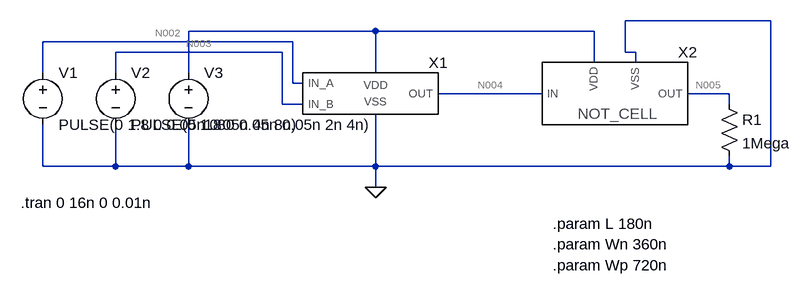
[diagram p0: schematic AND_SRAM_TB.asc]
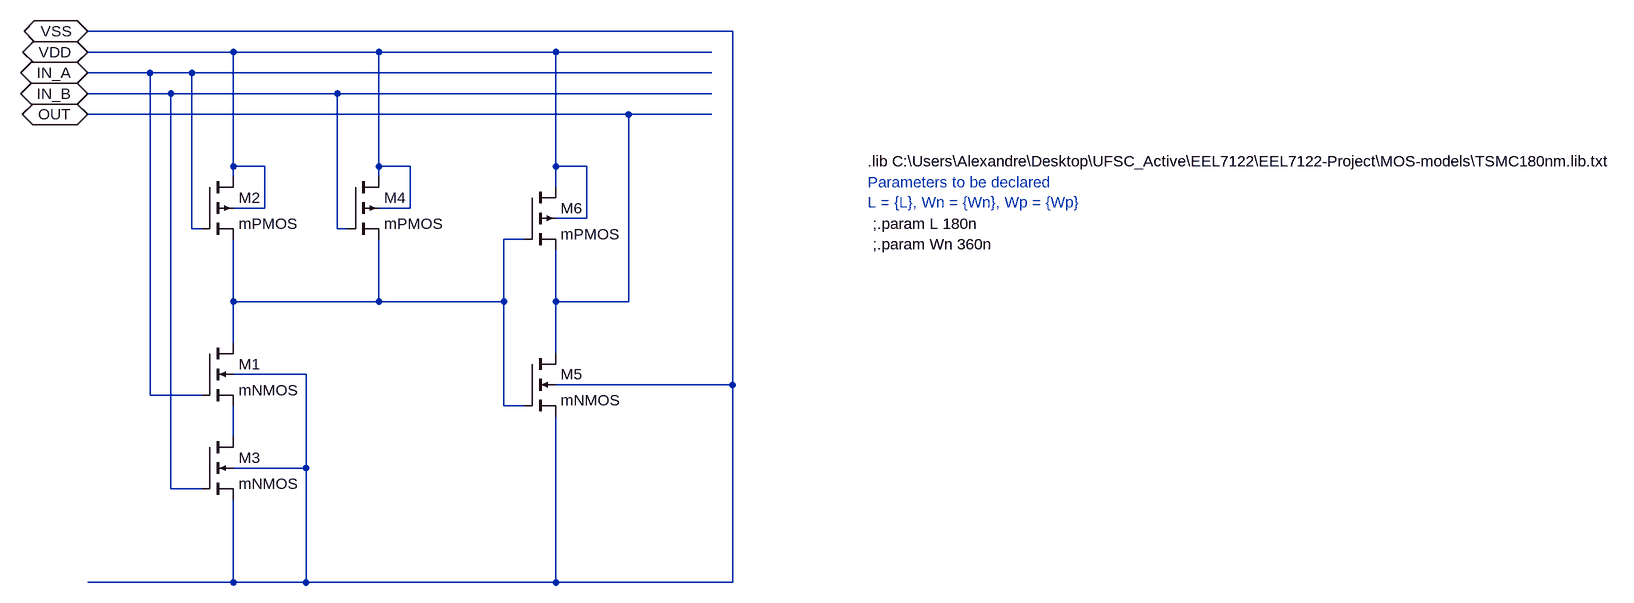
[diagram p1: sub-circuit and_sram.asc]
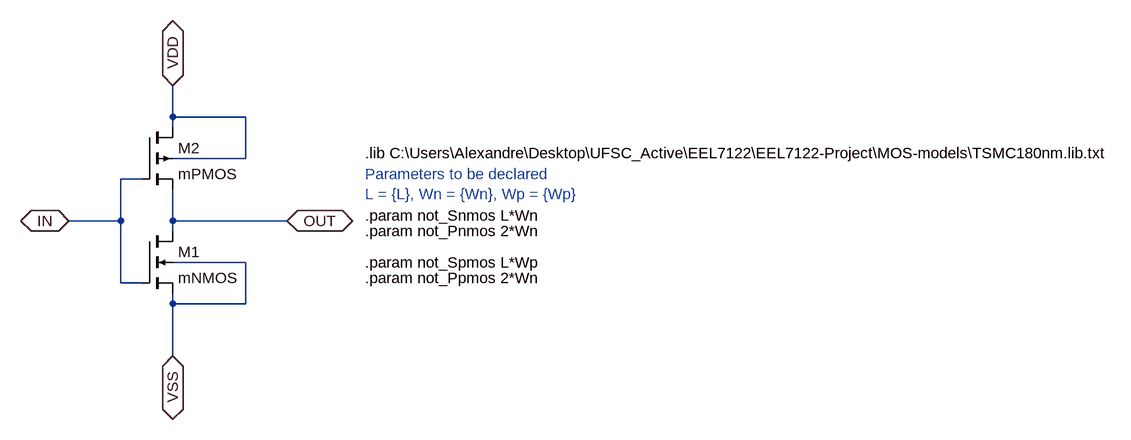
[diagram p2: sub-circuit not_cell.asc]
AND_SRAM_TB.asc, the LTspice schematic file:
Version 4
SHEET 1 884 680
WIRE 848 32 624 32
WIRE 240 48 -48 48
WIRE 576 48 240 48
WIRE 112 64 -272 64
WIRE 96 80 -160 80
WIRE 624 80 624 32
WIRE 640 80 624 80
WIRE 576 96 576 48
WIRE 640 96 640 80
WIRE -272 112 -272 64
WIRE -160 112 -160 80
WIRE -48 112 -48 48
WIRE 240 112 240 48
WIRE 112 128 112 64
WIRE 128 128 112 128
WIRE 496 144 336 144
WIRE 784 144 720 144
WIRE 96 160 96 80
WIRE 128 160 96 160
WIRE 784 160 784 144
WIRE -272 256 -272 192
WIRE -160 256 -160 192
WIRE -160 256 -272 256
WIRE -48 256 -48 192
WIRE -48 256 -160 256
WIRE 240 256 240 176
WIRE 240 256 -48 256
WIRE 784 256 784 240
WIRE 784 256 240 256
WIRE 848 256 848 32
WIRE 848 256 784 256
WIRE 240 288 240 256
FLAG 240 288 0
SYMBOL AND_SRAM 240 144 R0
SYMATTR InstName X1
SYMATTR SpiceLine L = {L}, Wn = {Wn}
SYMBOL voltage -272 96 R0
WINDOW 123 0 0 Left 0
WINDOW 39 0 0 Left 0
SYMATTR InstName V1
SYMATTR Value PULSE(0 1.8 0 0.05n 0.05n 4n 8n)
SYMBOL voltage -160 96 R0
WINDOW 123 0 0 Left 0
WINDOW 39 0 0 Left 0
SYMATTR InstName V2
SYMATTR Value PULSE(0 1.8 0 0.05n 0.05n 2n 4n)
SYMBOL voltage -48 96 R0
SYMATTR InstName V3
SYMATTR Value 1.8
SYMBOL NOT_CELL 608 144 R0
SYMATTR InstName X2
SYMATTR SpiceLine L = {L}, Wn = {Wn}, Wp = {Wp}
SYMBOL res 768 144 R0
SYMATTR InstName R1
SYMATTR Value 1Mega
TEXT -306 312 Left 2 !.tran 0 16n 0 0.01n
TEXT 512 344 Left 2 !.param L 180n
TEXT 512 376 Left 2 !.param Wn 360n
TEXT 512 408 Left 2 !.param Wp 720n

and_sram.asc, the sub-circuit schematic file:
Version 4
SHEET 1 2396 680
WIRE 928 -176 -64 -176
WIRE 160 -144 -64 -144
WIRE 384 -144 160 -144
WIRE 656 -144 384 -144
WIRE 896 -144 656 -144
WIRE 32 -112 -64 -112
WIRE 96 -112 32 -112
WIRE 896 -112 96 -112
WIRE 64 -80 -64 -80
WIRE 320 -80 64 -80
WIRE 896 -80 320 -80
WIRE 768 -48 -64 -48
WIRE 896 -48 768 -48
WIRE 160 32 160 -144
WIRE 208 32 160 32
WIRE 384 32 384 -144
WIRE 432 32 384 32
WIRE 656 32 656 -144
WIRE 704 32 656 32
WIRE 160 48 160 32
WIRE 384 48 384 32
WIRE 656 64 656 32
WIRE 208 96 208 32
WIRE 208 96 160 96
WIRE 432 96 432 32
WIRE 432 96 384 96
WIRE 704 112 704 32
WIRE 704 112 656 112
WIRE 96 128 96 -112
WIRE 112 128 96 128
WIRE 320 128 320 -80
WIRE 336 128 320 128
WIRE 608 144 576 144
WIRE 160 240 160 144
WIRE 384 240 384 144
WIRE 384 240 160 240
WIRE 576 240 576 144
WIRE 576 240 384 240
WIRE 656 240 656 160
WIRE 768 240 768 -48
WIRE 768 240 656 240
WIRE 160 304 160 240
WIRE 656 320 656 240
WIRE 272 352 160 352
WIRE 928 368 928 -176
WIRE 928 368 656 368
WIRE 32 384 32 -112
WIRE 112 384 32 384
WIRE 576 400 576 240
WIRE 608 400 576 400
WIRE 160 448 160 400
WIRE 272 496 272 352
WIRE 272 496 160 496
WIRE 64 528 64 -80
WIRE 112 528 64 528
WIRE 160 672 160 544
WIRE 160 672 -64 672
WIRE 272 672 272 496
WIRE 272 672 160 672
WIRE 656 672 656 416
WIRE 656 672 272 672
WIRE 928 672 928 368
WIRE 928 672 656 672
FLAG -64 -48 OUT
IOPIN -64 -48 BiDir
FLAG -64 -144 VDD
IOPIN -64 -144 BiDir
FLAG -64 -176 VSS
IOPIN -64 -176 BiDir
FLAG -64 -112 IN_A
IOPIN -64 -112 BiDir
FLAG -64 -80 IN_B
IOPIN -64 -80 BiDir
SYMBOL nmos4 112 304 R0
SYMATTR InstName M1
SYMATTR Value mNMOS
SYMATTR Value2 l={L} w={2*Wn} ad={2*L*Wn} as={2*L*Wn} pd={2*2*Wn} ps={2*2*Wn} m=1
SYMBOL pmos4 112 48 R0
SYMATTR InstName M2
SYMATTR Value mPMOS
SYMATTR Value2 l={L} w={Wp} ad={2*Wn*L} as={2*Wn*L} pd={2*2*Wn} ps={2*2*Wn} m=1
SYMBOL nmos4 112 448 R0
SYMATTR InstName M3
SYMATTR Value mNMOS
SYMATTR Value2 l={L} w={2*Wn} ad={2*L*Wn} as={2*L*Wn} pd={2*2*Wn} ps={2*2*Wn} m=1
SYMBOL pmos4 336 48 R0
SYMATTR InstName M4
SYMATTR Value mPMOS
SYMATTR Value2 l={L} w={Wp} ad={2*Wn*L} as={2*Wn*L} pd={2*2*Wn} ps={2*2*Wn} m=1
SYMBOL nmos4 608 320 R0
SYMATTR InstName M5
SYMATTR Value mNMOS
SYMATTR Value2 l={L} w={Wn} ad={L*Wn} as={L*Wn} pd={2*Wn} ps={2*Wn} m=1
SYMBOL pmos4 608 64 R0
SYMATTR InstName M6
SYMATTR Value mPMOS
SYMATTR Value2 l={L} w={Wp} ad={2*Wn*L} as={2*Wn*L} pd={2*2*Wn} ps={2*2*Wn} m=1
TEXT 1136 24 Left 2 !.lib C:\\Users\\Alexandre\\Desktop\\UFSC_Active\\EEL7122\\EEL7122-Project\\MOS-models\\TSMC180nm.lib.txt
TEXT 1144 120 Left 2 !;.param L 180n
TEXT 1144 152 Left 2 !;.param Wn 360n
TEXT 1136 56 Left 2 ;Parameters to be declared\nL = {L}, Wn = {Wn}, Wp = {Wp}

not_cell.asc, the sub-circuit schematic file:
Version 4
SHEET 1 1132 680
WIRE -592 -32 -592 -80
WIRE -480 -32 -592 -32
WIRE -592 -16 -592 -32
WIRE -480 32 -480 -32
WIRE -480 32 -592 32
WIRE -640 64 -672 64
WIRE -672 128 -672 64
WIRE -672 128 -752 128
WIRE -592 128 -592 80
WIRE -416 128 -592 128
WIRE -592 144 -592 128
WIRE -480 192 -592 192
WIRE -672 224 -672 128
WIRE -640 224 -672 224
WIRE -592 256 -592 240
WIRE -480 256 -480 192
WIRE -480 256 -592 256
WIRE -592 336 -592 256
FLAG -752 128 IN
IOPIN -752 128 BiDir
FLAG -416 128 OUT
IOPIN -416 128 BiDir
FLAG -592 336 VSS
IOPIN -592 336 BiDir
FLAG -592 -80 VDD
IOPIN -592 -80 BiDir
SYMBOL nmos4 -640 144 R0
SYMATTR InstName M1
SYMATTR Value mNMOS
SYMATTR Value2 l={L} w={Wn} ad={not_Snmos} as={not_Snmos} pd={not_Pnmos} ps={not_Pnmos} m=1
SYMBOL pmos4 -640 -16 R0
SYMATTR InstName M2
SYMATTR Value mPMOS
SYMATTR Value2 l={L} w={WP} ad={not_Spmos} as={not_Spmos} pd={not_Ppmos} ps={not_Ppmos} m=1
TEXT -296 24 Left 2 !.lib C:\\Users\\Alexandre\\Desktop\\UFSC_Active\\EEL7122\\EEL7122-Project\\MOS-models\\TSMC180nm.lib.txt
TEXT -296 192 Left 2 !.param not_Spmos L*Wp
TEXT -296 216 Left 2 !.param not_Ppmos 2*Wn
TEXT -296 120 Left 2 !.param not_Snmos L*Wn
TEXT -296 144 Left 2 !.param not_Pnmos 2*Wn
TEXT -296 56 Left 2 ;Parameters to be declared\nL = {L}, Wn = {Wn}, Wp = {Wp}

The netlist it stands for:
* AND_SRAM_TB.asc
XX1 N002 N003 N004 N001 0 and_sram params: L = {L}, Wn = {Wn}
V1 N002 0 PULSE(0 1.8 0 0.05n 0.05n 4n 8n)
V2 N003 0 PULSE(0 1.8 0 0.05n 0.05n 2n 4n)
V3 N001 0 1.8
XX2 N004 N005 N001 0 not_cell params: L = {L}, Wn = {Wn}, Wp = {Wp}
R1 N005 0 1Mega

* block symbol definitions
.subckt and_sram IN_A IN_B OUT VDD VSS
M1 N001 IN_A N002 VSS mNMOS l={L} w={2*Wn} ad={2*L*Wn} as={2*L*Wn} pd={2*2*Wn} ps={2*2*Wn} m=1
M2 VDD IN_A N001 VDD mPMOS l={L} w={Wp} ad={2*Wn*L} as={2*Wn*L} pd={2*2*Wn} ps={2*2*Wn} m=1
M3 N002 IN_B VSS VSS mNMOS l={L} w={2*Wn} ad={2*L*Wn} as={2*L*Wn} pd={2*2*Wn} ps={2*2*Wn} m=1
M4 VDD IN_B N001 VDD mPMOS l={L} w={Wp} ad={2*Wn*L} as={2*Wn*L} pd={2*2*Wn} ps={2*2*Wn} m=1
M5 OUT N001 VSS VSS mNMOS l={L} w={Wn} ad={L*Wn} as={L*Wn} pd={2*Wn} ps={2*Wn} m=1
M6 VDD N001 OUT VDD mPMOS l={L} w={Wp} ad={2*Wn*L} as={2*Wn*L} pd={2*2*Wn} ps={2*2*Wn} m=1
.lib C:\Users\Alexandre\Desktop\UFSC_Active\EEL7122\EEL7122-Project\MOS-models\TSMC180nm.lib.txt
;.param L 180n
;.param Wn 360n
* Parameters to be declared
* L = {L}, Wn = {Wn}, Wp = {Wp}
.ends and_sram

.subckt not_cell IN OUT VDD VSS
M1 OUT IN VSS VSS mNMOS l={L} w={Wn} ad={not_Snmos} as={not_Snmos} pd={not_Pnmos} ps={not_Pnmos} m=1
M2 VDD IN OUT VDD mPMOS l={L} w={WP} ad={not_Spmos} as={not_Spmos} pd={not_Ppmos} ps={not_Ppmos} m=1
.lib C:\Users\Alexandre\Desktop\UFSC_Active\EEL7122\EEL7122-Project\MOS-models\TSMC180nm.lib.txt
.param not_Spmos L*Wp
.param not_Ppmos 2*Wn
.param not_Snmos L*Wn
.param not_Pnmos 2*Wn
* Parameters to be declared
* L = {L}, Wn = {Wn}, Wp = {Wp}
.ends not_cell

.model NMOS NMOS
.model PMOS PMOS
.lib standard.mos
.tran 0 16n 0 0.01n
.param L 180n
.param Wn 360n
.param Wp 720n
.backanno
.end

* Results of the author's LTspice run, read from the files saved beside the schematic
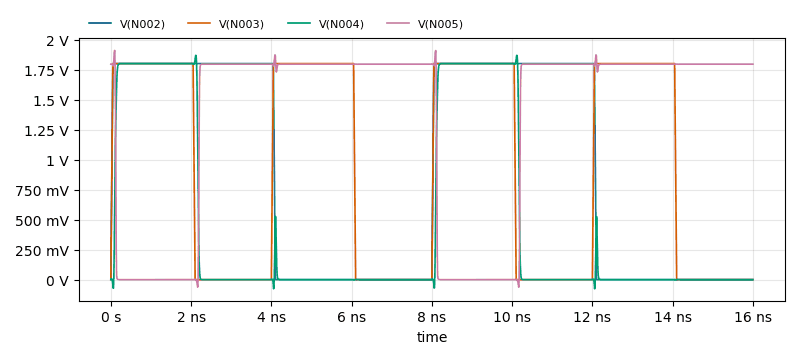
[diagram p3: Transient Analysis of AND_SRAM_TB.asc, plotted from the saved traces]
* Transient Analysis, 1 run:
*   V(N002): min 0 V, max 1.8 V, average 911.2 mV, rms 1.278 V, last 0 V
*   V(N003): min 0 V, max 1.8 V, average 922.5 mV, rms 1.284 V, last 0 V
*   V(N004): min -76.33 mV, max 1.869 V, average 466.7 mV, rms 909.8 mV, last 0 V
*   V(N005): min -62.83 mV, max 1.91 V, average 1.33 V, rms 1.544 V, last 1.795 V